# EAGLE design Line Sensor (EAGLE 9.5.2)
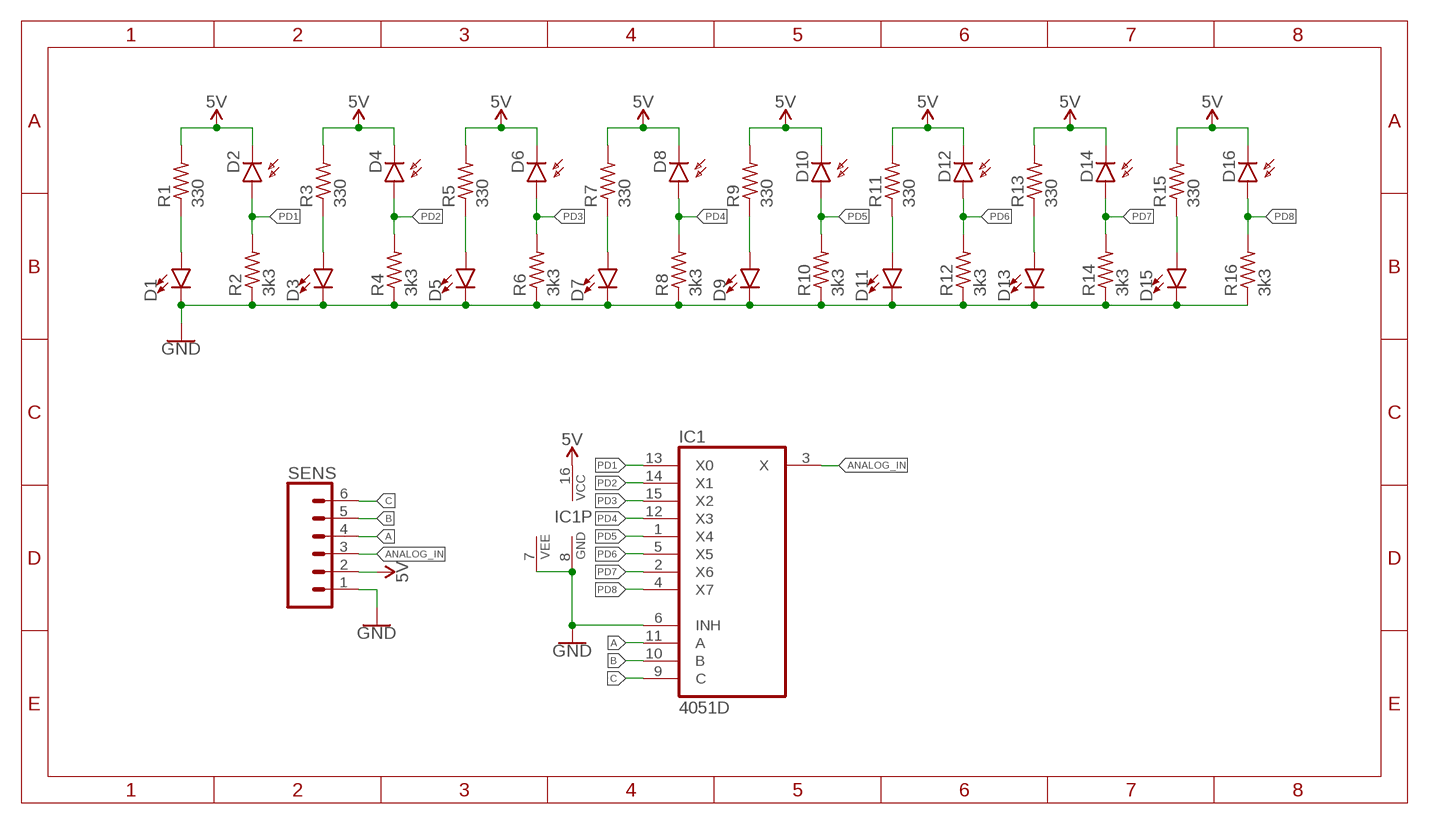
[diagram p0: schematic, sheet 1]

## Parts
D1  LED3MM  [LED_3MM]
D2  SFH225  [SFH225]
D3  LED3MM  [LED_3MM]
D4  SFH225  [SFH225]
D5  LED3MM  [LED_3MM]
D6  SFH225  [SFH225]
D7  LED3MM  [LED_3MM]
D8  SFH225  [SFH225]
D9  LED3MM  [LED_3MM]
D10  SFH225  [SFH225]
D11  LED3MM  [LED_3MM]
D12  SFH225  [SFH225]
D13  LED3MM  [LED_3MM]
D14  SFH225  [SFH225]
D15  LED3MM  [LED_3MM]
D16  SFH225  [SFH225]
IC1  4051D  [SO16]
R1  330  R-US_0207/9  [0207/9]
R2  3k3  R-US_0207/9  [0207/9]
R3  330  R-US_0207/9  [0207/9]
R4  3k3  R-US_0207/9  [0207/9]
R5  330  R-US_0207/9  [0207/9]
R6  3k3  R-US_0207/9  [0207/9]
R7  330  R-US_0207/9  [0207/9]
R8  3k3  R-US_0207/9  [0207/9]
R9  330  R-US_0207/9  [0207/9]
R10  3k3  R-US_0207/9  [0207/9]
R11  330  R-US_0207/9  [0207/9]
R12  3k3  R-US_0207/9  [0207/9]
R13  330  R-US_0207/9  [0207/9]
R14  3k3  R-US_0207/9  [0207/9]
R15  330  R-US_0207/9  [0207/9]
R16  3k3  R-US_0207/9  [0207/9]
SENS  CONN_06SILK_FEMALE_PTH  [1X06]

## Nets
5V: D2.K(C) D4.K(C) D6.K(C) D8.K(C) D10.K(C) D12.K(C) D14.K(C) D16.K(C) IC1.16(VCC) R1.2 R3.2 R5.2 R7.2 R9.2 R11.2 R13.2 R15.2 SENS.2
A: IC1.11(A) SENS.4
ANALOG_IN: IC1.3(X) SENS.3
B: IC1.10(B) SENS.5
C: IC1.9(C) SENS.6
GND: D1.K(C) D3.K(C) D5.K(C) D7.K(C) D9.K(C) D11.K(C) D13.K(C) D15.K(C) IC1.6(INH) IC1.7(VEE) IC1.8(GND) R2.1 R4.1 R6.1 R8.1 R10.1 R12.1 R14.1 R16.1 SENS.1
N$1: D15.A R15.1
N$2: D13.A R13.1
N$3: D11.A R11.1
N$4: D9.A R9.1
N$5: D7.A R7.1
N$6: D5.A R5.1
N$7: D3.A R3.1
N$8: D1.A R1.1
PD1: D2.A IC1.13(X0) R2.2
PD2: D4.A IC1.14(X1) R4.2
PD3: D6.A IC1.15(X2) R6.2
PD4: D8.A IC1.12(X3) R8.2
PD5: D10.A IC1.1(X4) R10.2
PD6: D12.A IC1.5(X5) R12.2
PD7: D14.A IC1.2(X6) R14.2
PD8: D16.A IC1.4(X7) R16.2

## Library data of the parts
D1 D3 D5 D7 D9 D11 D13 D15 = SparkFun-LED:LED: LED (Generic) Standard schematic elements and footprints for 5mm, 3mm, 1206, and 0603 sized LEDs. Generic LEDs with no color specified.; PROD_ID: DIO-08794
D2 D4 D6 D8 D10 D12 D14 D16 = opto-trans-siemens:SFH225: PHOTO DIODE; OC_FARNELL: unknown; OC_NEWARK: unknown
IC1 = 40xx:4051: 8-channel ANALOG MULTIPLEXER
R1-R16 = adafruit:R-US_: RESISTOR, American symbol
SENS = SparkFun-Connectors:CONN_06: Multi connection point. Often used as Generic Header-pin footprint for 0.1 inch spaced/style header connections On any of the 0.1 inch spaced packages, you can populate with these: Break Away Headers - Straight <https://www.sparkfun.com/products/116> (PRT-00116) Break Away Male Headers - Right Angle <https://www.sparkfun.com/products/553> (PRT-00553) Female Headers <https://www.sparkfun.com/products/115> (PRT-00115) Break Away Headers - Machine Pin <https://www.sparkfun.com/products/117> (PRT-00117) Break Away Female Headers - Swiss Machine Pin <https://www.sparkfun.com/products/743> (PRT-00743) Arduino Stackable Header - 6 Pin <https://www.sparkfun.com/products/9280> (PRT-09280) For SCREWTERMINALS and SPRING TERMINALS visit here: Screw Terimnals on SparkFun.com <https://www.sparkfun.com/search/results?term=Screw+Terminals> (5mm/3.5mm/2.54mm spacing) This device is also useful as a general connection point to wire up your design to another part of your project. Our various solder wires solder well into these plated through hole pads. Hook-Up Wire - Assortment (Stranded, 22 AWG) <https://www.sparkfun.com/products/11375> (PRT-11375) Hook-Up Wire - Assortment (Solid Core, 22 AWG) <https://www.sparkfun.com/products/11367> (PRT-11367) View the entire wire category on our website here <https://www.sparkfun.com/categories/141>; PROD_ID: CONN-08437

## Board
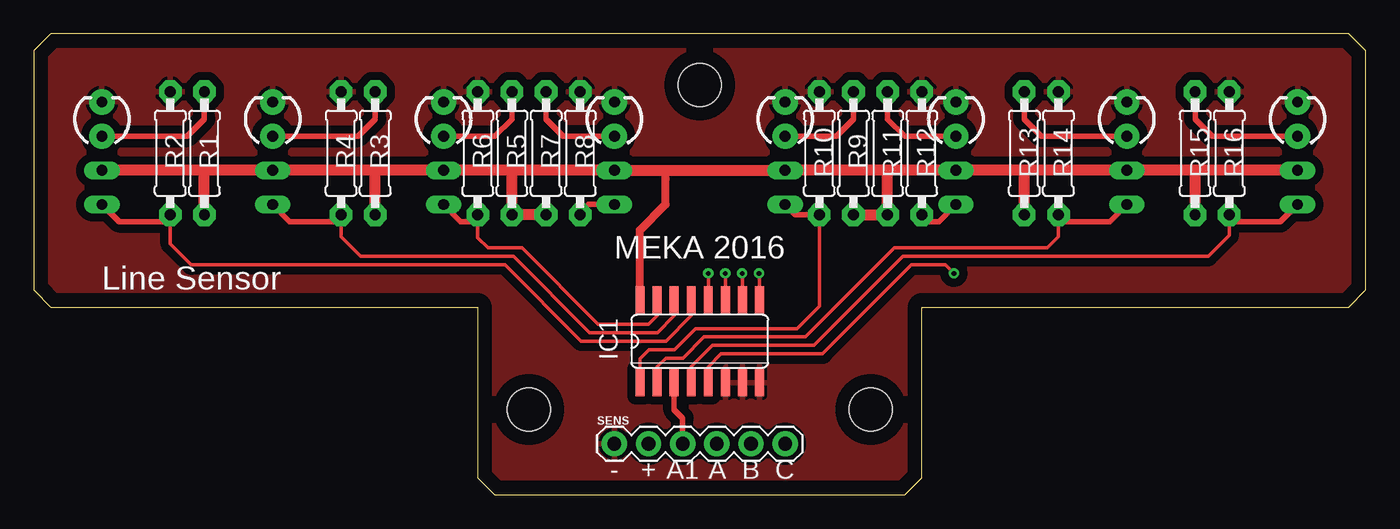
[diagram p1: board, top side]
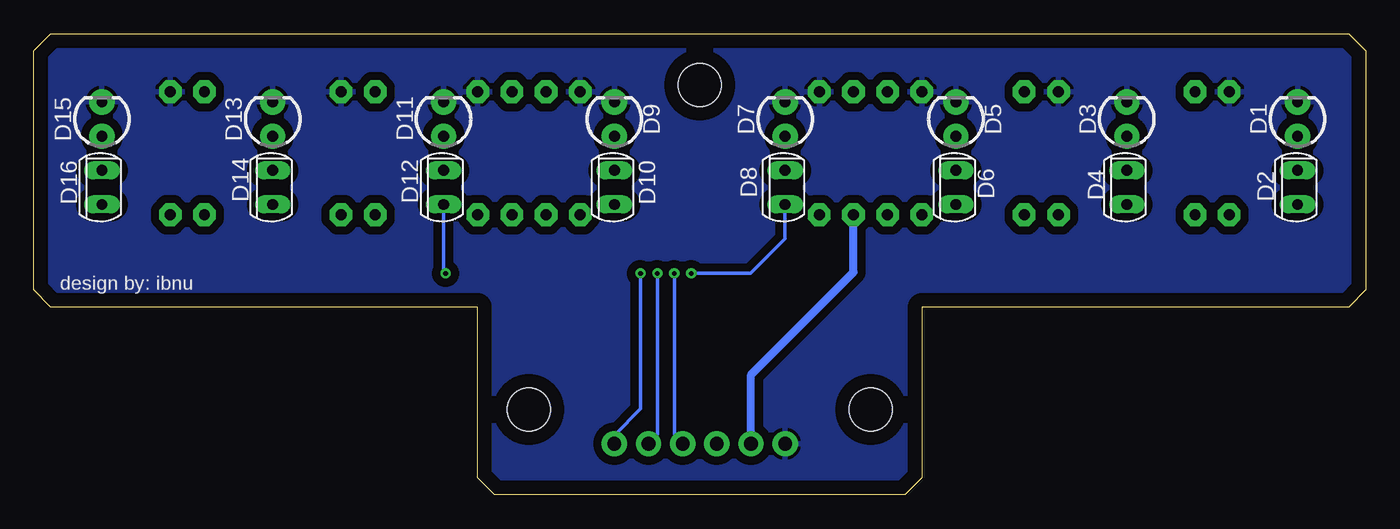
[diagram p2: board, bottom side, seen from below]

Size 99.06 x 34.29 mm. Coordinates in mm from the lower left corner, seen from the top.
Outline: 1.27,34.29 0,33.02 0,15.24 1.27,13.97 33.02,13.97 33.02,1.27 34.29,0 64.77,0 66.04,1.27 66.04,13.97 97.79,13.97 99.06,15.24 99.06,33.02 97.79,34.29 1.27,34.29
Copper layers (1*16): Top 0.035mm / dielectric 1.5mm / Bottom 0.035mm
Design rules "default": minimum track width 6mil, minimum drill 0.35mm, track to track 6mil, track to pad 6mil, pad to pad 6mil, via to via 6mil, smd to smd 6mil, copper to edge 40mil, drill to drill 6mil, minimum pad ring 10mil, minimum via ring 8mil, stop-mask expansion 4mil, vias tented up to drill 0mil, thermal gap 10mil
Holes 3.2 mm at 49.53,30.48 62.23,6.35 36.83,6.35

### Footprints (pad centres in the part's own frame; a part is rotated, then mirrored left to right if it is on the bottom)
LED_3MM = drill 0.813 pad 1.88: A -1.27,0; K 1.27,0
SFH225 = drill 0.813 long: A 0,1.27; K 0,-1.27
SO16 = smd 0.66 x 2.032: 1 -4.445,-3.073; 2 -3.175,-3.073; 3 -1.905,-3.073; 4 -0.635,-3.073; 5 0.635,-3.073; 6 1.905,-3.073; 7 3.175,-3.073; 8 4.445,-3.073; 9 4.445,3.073; 10 3.175,3.073; 11 1.905,3.073; 12 0.635,3.073; 13 -0.635,3.073; 14 -1.905,3.073; 15 -3.175,3.073; 16 -4.445,3.073
0207/9 = drill 0.813 pad 1.676 octagon: 1 -4.572,0; 2 4.572,0
1X06 = drill 1.016 pad 1.88: 1 0,0; 2 2.54,0; 3 5.08,0; 4 7.62,0; 5 10.16,0; 6 12.7,0

### Placement (x,y rotation side)
D1  5.08,27.94 90 bottom
D2  5.08,22.86 180 bottom
D3  17.78,27.94 90 bottom
D4  17.78,22.86 180 bottom
D5  30.48,27.94 90 bottom
D6  30.48,22.86 180 bottom
D7  43.18,27.94 90 bottom
D8  43.18,22.86 180 bottom
D9  55.88,27.94 90 bottom
D10  55.88,22.86 180 bottom
D11  68.58,27.94 90 bottom
D12  68.58,22.86 180 bottom
D13  81.28,27.94 90 bottom
D14  81.28,22.86 180 bottom
D15  93.98,27.94 90 bottom
D16  93.98,22.86 180 bottom
IC1  49.53,11.43 0 top
R1  12.7,25.4 270 top
R2  10.16,25.4 270 top
R3  25.4,25.4 270 top
R4  22.86,25.4 270 top
R5  35.56,25.4 270 top
R6  33.02,25.4 270 top
R7  38.1,25.4 270 top
R8  40.64,25.4 270 top
R9  60.96,25.4 270 top
R10  58.42,25.4 270 top
R11  63.5,25.4 270 top
R12  66.04,25.4 270 top
R13  73.66,25.4 270 top
R14  76.2,25.4 270 top
R15  86.36,25.4 270 top
R16  88.9,25.4 270 top
SENS  43.18,3.81 0 top

### Tracks (layer width: path | path; a pad name or v marks a point on that pad's centre or on a via)
5V
  Top 0.61: IC1.16 45.09,19.69 46.99,21.59 46.99,23.49 46.99,24.12
  Top 0.813: R9.2 R11.2 63.5,24.13 | R7.2 R5.2 35.56,24.13 | D16.K 86.36,24.13 | 86.36,24.13 D14.K 73.66,24.13 | 73.66,24.13 D12.K 63.5,24.13 | 63.5,24.13 D10.K 55.25,24.13 55.24,24.12 46.99,24.12 43.82,24.12 43.81,24.13 D8.K 35.56,24.13 | 35.56,24.13 D6.K 25.4,24.13 | 25.4,24.13 D4.K 12.7,24.13 | 12.7,24.13 D2.K | R1.2 12.7,24.13 | R3.2 25.4,24.13 | R13.2 73.66,24.13 | R15.2 86.36,24.13
  Bottom 0.61: SENS.2 45.72,8.94 38.1,16.56 R7.2
A  (via drill 0.35)
  Top 0.254: v51.42,16.47 51.44,16.45 IC1.11
  Bottom 0.254: SENS.4 50.8,3.88 51.42,4.5 v51.42,16.47
ANALOG_IN
  Top 0.406: SENS.3 48.26,5.71 47.62,6.35 IC1.3
B  (via drill 0.35)
  Top 0.254: v52.68,16.47 52.7,16.45 IC1.10
  Bottom 0.254: SENS.5 53.34,3.84 52.68,4.5 v52.68,16.47
C  (via drill 0.35)
  Top 0.254: v53.94,16.47 53.98,16.43 IC1.9
  Bottom 0.254: SENS.6 55.88,4.45 53.94,6.39 v53.94,16.47
GND
  pour Top (isolate 0.61, rank 3): -1.27,35.56 100.33,35.56 100.33,-1.27 -1.27,-1.27
  pour Bottom (isolate 0.61, rank 3): -2.54,36.83 101.6,36.83 101.6,-2.54 -2.54,-2.54
N$1
  Top 0.406: R15.1 86.36,27.94 87.63,26.67 D15.A
N$2
  Top 0.406: D13.A 74.93,26.67 73.66,27.94 R13.1
N$3
  Top 0.406: R11.1 63.5,27.94 64.77,26.67 D11.A
N$4
  Top 0.406: D9.A 59.69,26.67 60.96,27.94 R9.1
N$5
  Top 0.406: D7.A 39.37,26.67 38.1,27.94 R7.1
N$6
  Top 0.406: D5.A 34.29,26.67 35.56,27.94 R5.1
N$7
  Top 0.406: D3.A 24.13,26.67 25.4,27.94 R3.1
N$8
  Top 0.406: D1.A 11.43,26.67 12.7,27.94 R1.1
PD1
  Top 0.254: IC1.13 48.9,13.31 47.01,11.43 40.71,11.43 35.04,17.1 11.73,17.1 10.16,18.67 R2.2
  Top 0.406: D2.A 6.35,20.32 9.65,20.32 R2.2
PD2
  Top 0.254: IC1.14 47.62,13.3 46.38,12.06 41.34,12.06 35.67,17.73 24.33,17.73 22.86,19.2 R4.2
  Top 0.406: D4.A 19.05,20.32 22.35,20.32 R4.2
PD3
  Top 0.254: IC1.15 46.36,13.33 45.72,12.7 41.96,12.7 36.3,18.36 33.78,18.36 33.02,19.12 R6.2
  Top 0.406: D6.A 31.75,20.32 32.51,20.32 R6.2
PD4  (via drill 0.35)
  Top 0.254: IC1.12 v50.16,16.46 v50.16,16.47
  Top 0.406: D8.A 41.27,21.59 40.64,20.95 R8.2
  Bottom 0.254: v50.16,16.47 45.75,16.47 43.18,19.04 D8.A
PD5
  Top 0.254: IC1.1 45.09,10.13 45.75,10.8 47.64,10.8 49.21,12.37 56.77,12.37 58.42,14.02 R10.2
  Top 0.406: R10.2 56.64,20.83 D10.A
PD6  (via drill 0.35)
  Top 0.254: IC1.5 50.16,9.54 51.11,10.49 58.67,10.49 65.28,17.1 67.8,17.1 v68.43,16.47
  Top 0.406: D12.A 67.31,20.32 66.55,20.32 R12.2
  Bottom 0.254: v68.43,16.47 68.58,16.62 D12.A
PD7
  Top 0.254: IC1.2 46.36,9.52 47.01,10.17 48.27,10.17 49.85,11.75 57.41,11.75 64.02,18.36 75.36,18.36 76.2,19.2 R14.2
  Top 0.406: D14.A 80.01,20.32 76.71,20.32 R14.2
PD8
  Top 0.254: IC1.4 48.9,9.54 50.48,11.12 58.04,11.12 64.65,17.73 87.33,17.73 88.9,19.3 R16.2
  Top 0.406: D16.A 92.71,20.32 89.41,20.32 R16.2

### Text on the board
tNames: MEKA 2016 | Line Sensor | - | + | A1 | A | B | C
bNames: design by: ibnu